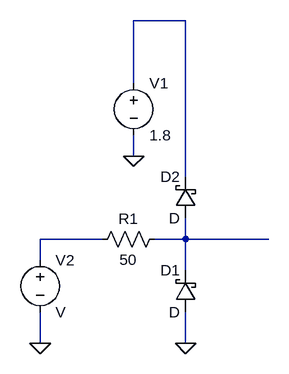
[diagram p0: schematic Draft1.asc]
Draft1.asc, the LTspice schematic file:
Version 4
SHEET 1 880 680
WIRE 208 -192 128 -192
WIRE 128 -96 128 -192
WIRE 128 16 128 -16
WIRE 208 48 208 -192
WIRE 80 144 -16 144
WIRE 208 144 208 112
WIRE 208 144 160 144
WIRE 336 144 208 144
WIRE -16 176 -16 144
WIRE 208 192 208 144
WIRE -16 304 -16 256
WIRE 208 304 208 256
FLAG 208 304 0
FLAG 128 16 0
FLAG -16 304 0
SYMBOL res 176 128 R90
WINDOW 0 0 56 VBottom 2
WINDOW 3 32 56 VTop 2
SYMATTR InstName R1
SYMATTR Value 50
SYMBOL schottky 224 256 R180
WINDOW 0 24 64 Left 2
WINDOW 3 24 0 Left 2
SYMATTR InstName D1
SYMBOL schottky 224 112 R180
WINDOW 0 24 64 Left 2
WINDOW 3 24 0 Left 2
SYMATTR InstName D2
SYMBOL voltage 128 -112 R0
WINDOW 123 0 0 Left 2
WINDOW 39 0 0 Left 2
SYMATTR InstName V1
SYMATTR Value 1.8
SYMBOL voltage -16 160 R0
SYMATTR InstName V2

The netlist it stands for:
* Draft1.asc
R1 N003 N002 50
D1 0 N003 D
D2 N003 N001 D
V1 N001 0 1.8
V2 N002 0 V
.model D D
.lib standard.dio
.backanno
.end